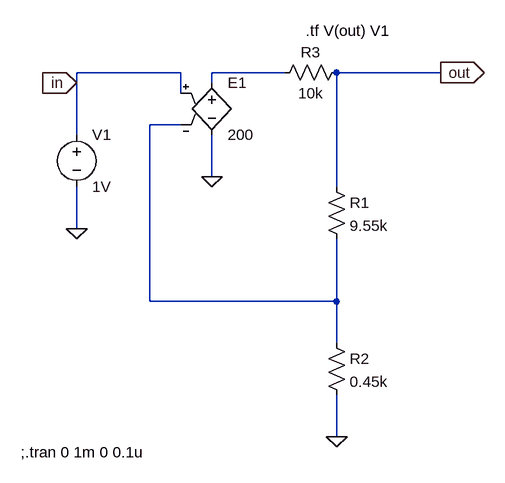
[diagram p0: schematic Draft2.asc]
Draft2.asc, the LTspice schematic file:
Version 4
SHEET 1 880 680
WIRE 144 16 -16 16
WIRE 304 16 192 16
WIRE 544 16 384 16
WIRE -16 32 -16 16
WIRE 192 32 192 16
WIRE 144 48 144 16
WIRE 144 96 96 96
WIRE -16 112 -16 32
WIRE 192 176 192 112
WIRE 384 192 384 16
WIRE -16 256 -16 192
WIRE 96 368 96 96
WIRE 384 368 384 272
WIRE 384 368 96 368
WIRE 384 432 384 368
WIRE 384 576 384 512
FLAG -16 256 0
FLAG 384 576 0
FLAG 192 176 0
FLAG 544 16 out
IOPIN 544 16 Out
FLAG -16 32 in
IOPIN -16 32 In
SYMBOL voltage -16 96 R0
WINDOW 123 0 0 Left 0
WINDOW 39 0 0 Left 0
SYMATTR InstName V1
SYMATTR Value 1V
SYMBOL e 192 16 R0
SYMATTR InstName E1
SYMATTR Value 200
SYMBOL res 368 176 R0
SYMATTR InstName R1
SYMATTR Value 9.55k
SYMBOL res 368 416 R0
SYMATTR InstName R2
SYMATTR Value 0.45k
SYMBOL res 400 0 R90
WINDOW 0 0 56 VBottom 2
WINDOW 3 32 56 VTop 2
SYMATTR InstName R3
SYMATTR Value 10k
TEXT -102 600 Left 2 !;.tran 0 1m 0 0.1u
TEXT 336 -48 Left 2 !.tf V(out) V1

The netlist it stands for:
* Draft2.asc
V1 in 0 1V
E1 N001 0 in N002 200
R1 out N002 9.55k
R2 N002 0 0.45k
R3 out N001 10k
;.tran 0 1m 0 0.1u
.tf V(out) V1
.backanno
.end